# Altium schematic sheet CPCISerial_connector.SchDoc: CPCIS connector
size 420 x 297 mm; CheckedBy: A.Paixao; CompanyName: CERN; DrawnBy: G. Daniluk; Engineer: G. Daniluk; Organization: CERN; Address1: European Organization for Nuclear Research; Address2: CH-1211 Genève 23 - Switzerland; DocumentNumber: 10; SheetNumber: 10; SheetTotal: 10; Title2: P1; DivGrp: BE/CO; Designer: G. Daniluk; Projet: Banker; ModifiedBy: G.Kasprowicz; CheckedDate: 18/06/2018; ProjectName: Distributed I/O Tier
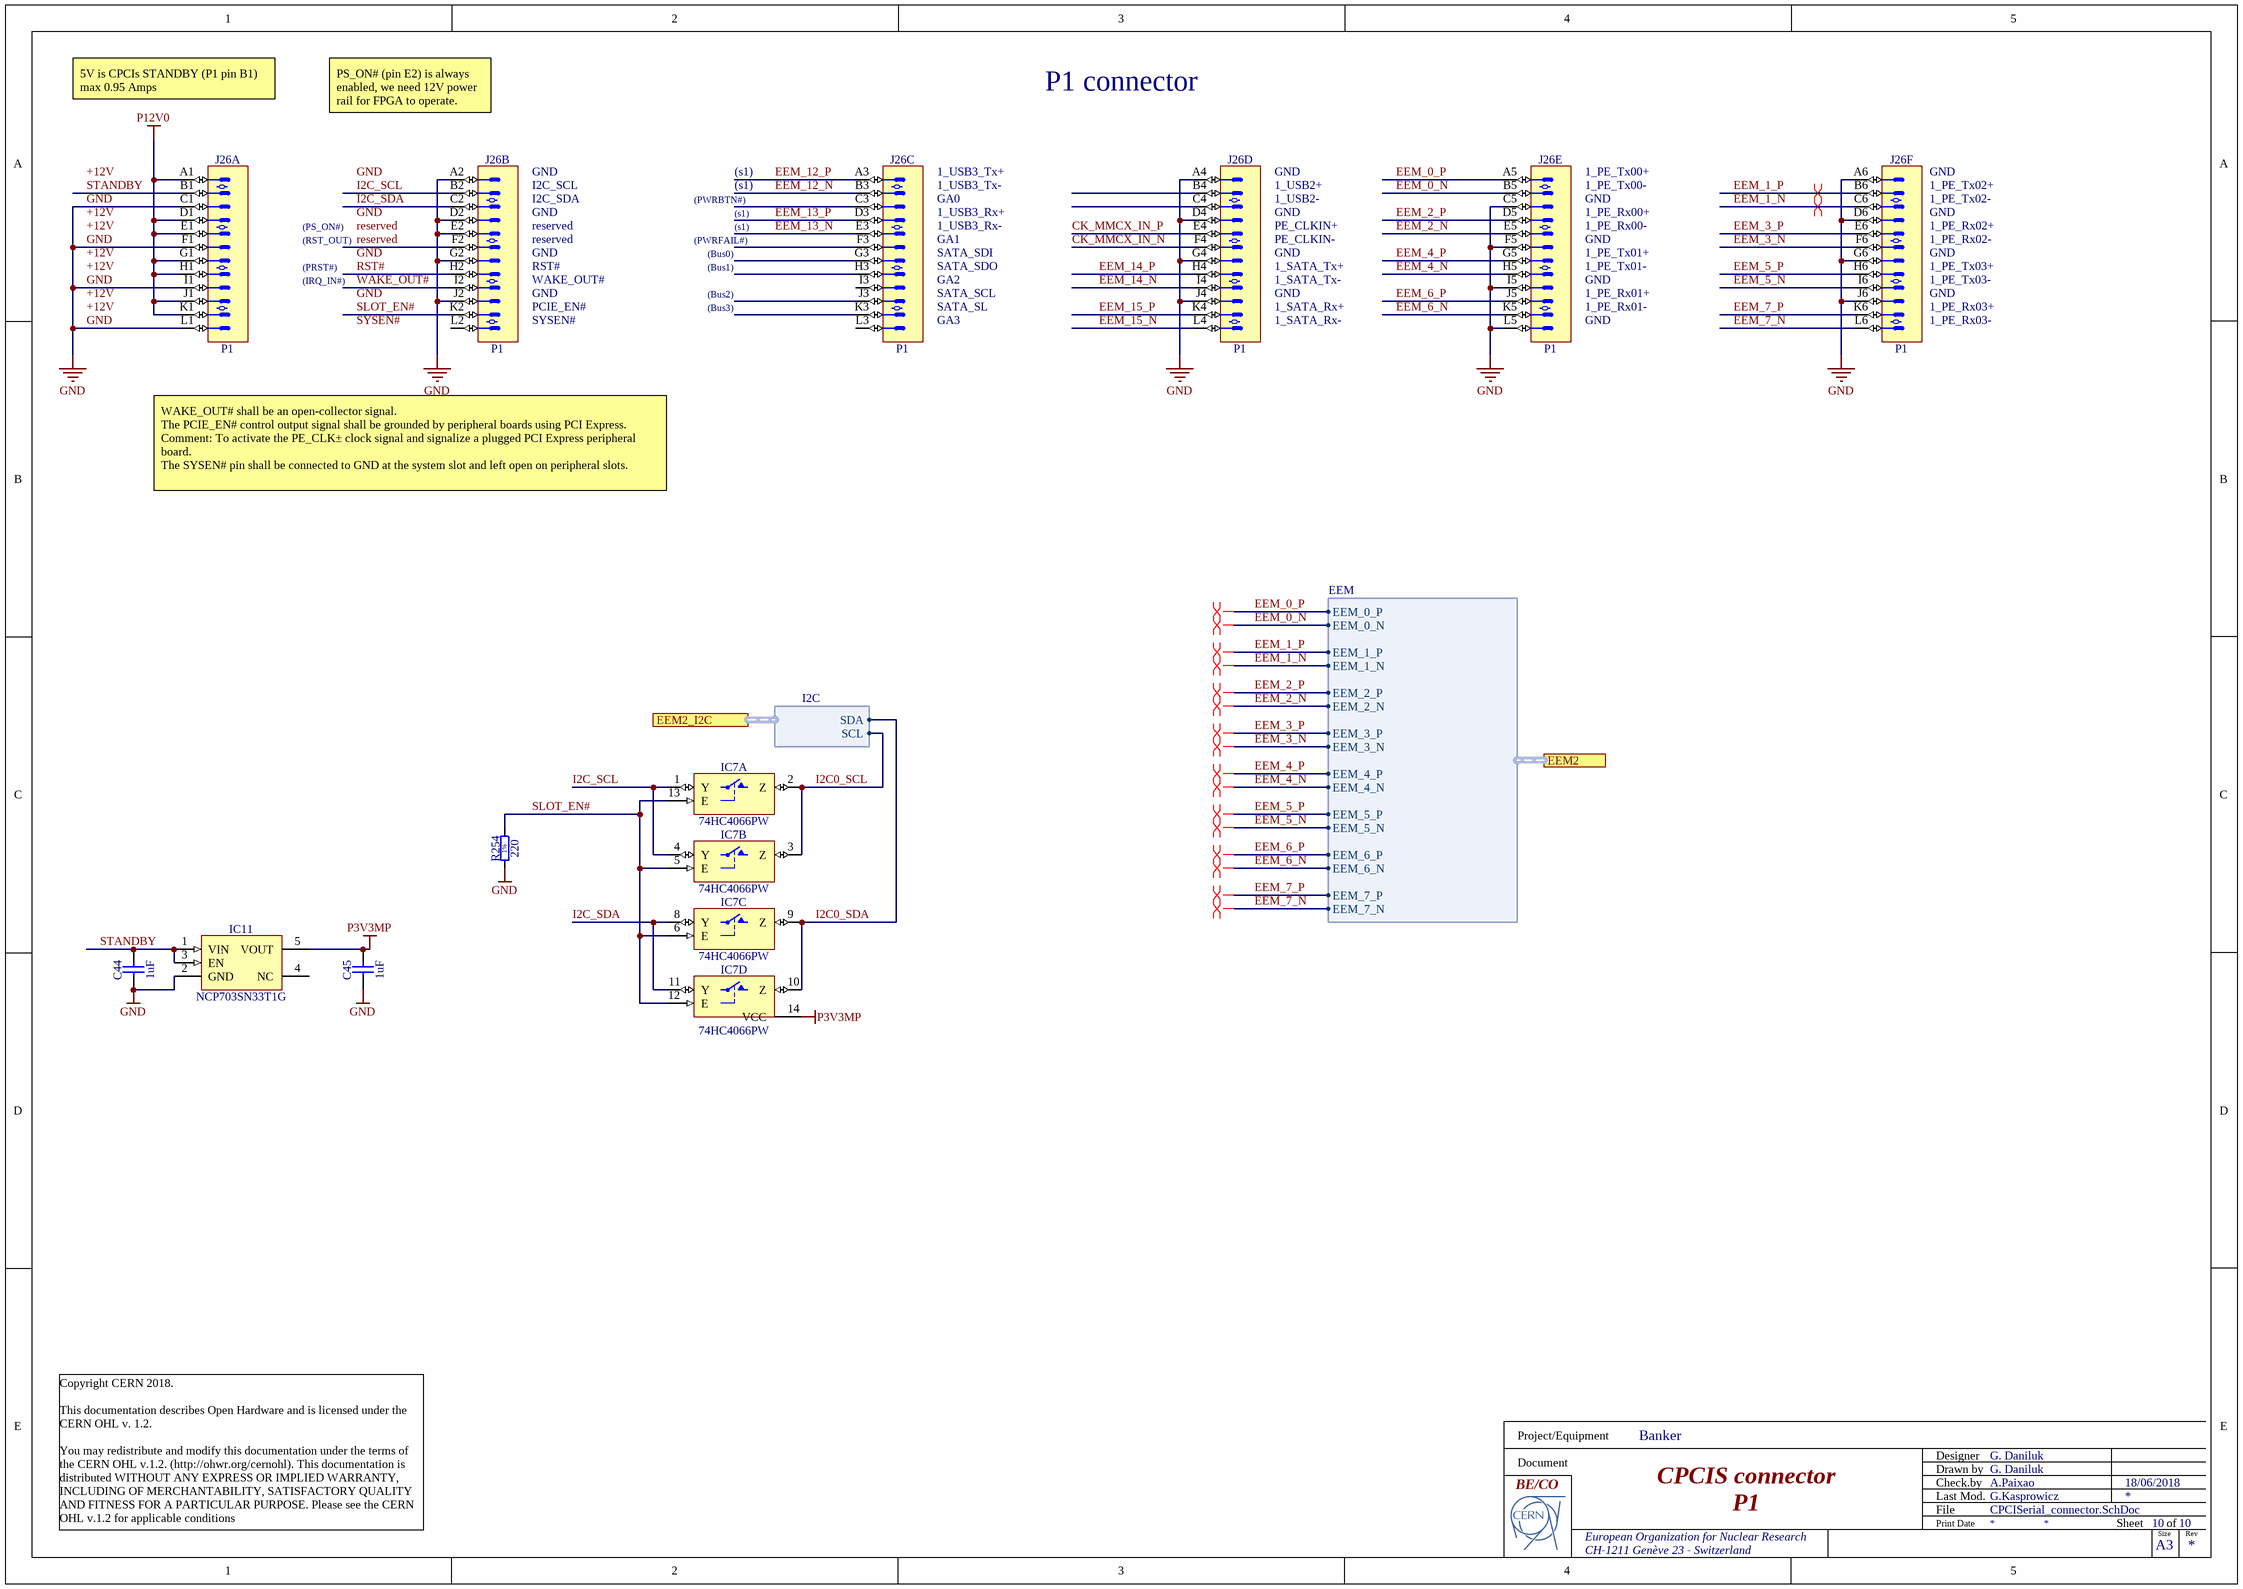
[diagram p0: CPCISerial_connector.SchDoc]

## Parts
C44  1uF  [CAPC2012X140N]
C45  1uF  [CAPC2012X140N]
IC7  74HC4066PW  [SOP65P640X110-14N]  (parts A,B,C,D of 4)
IC11  NCP703SN33T1G  [SOT95P275X110-5N]
J26  P1  [AMPHENOL_10052825-101LF]  (parts A,B,C,D,E,F of 6)
R254  220  [RESC1608X55N]

## Ports
EEM2 (harness EEM), EEM2_I2C (harness I2C)

## Harnesses
EEM: EEM_0_P, EEM_0_N, EEM_1_P, EEM_1_N, EEM_2_P, EEM_2_N, EEM_3_P, EEM_3_N, EEM_4_P, EEM_4_N, EEM_5_P, EEM_5_N, EEM_6_P, EEM_6_N, EEM_7_P, EEM_7_N
I2C: SDA, SCL

## Nets
GND: C44.1 C45.1 IC7.7(GND) IC11.2(GND) J26.A2 J26.A4 J26.A6 J26.C1 J26.C5 J26.D2 J26.D4 J26.D6 J26.E2 J26.F1 J26.F5 J26.G2 J26.G4 J26.G6 J26.I1 J26.I5 J26.J2 J26.J4 J26.J6 J26.L1 J26.L5 R254.1
P3V3MP: C45.2 IC7.14(VCC) IC11.5(VOUT)
P12V0: J26.A1 J26.D1 J26.E1 J26.G1 J26.H1 J26.J1 J26.K1
VCC: IC7.14(VCC)
CK_MMCX_IN_N: J26.F4
CK_MMCX_IN_P: J26.E4
EEM_0_N: J26.B5 ; port EEM2.EEM_0_N
EEM_0_P: J26.A5 ; port EEM2.EEM_0_P
EEM_1_N: J26.C6 ; port EEM2.EEM_1_N
EEM_1_P: J26.B6 ; port EEM2.EEM_1_P
EEM_2_N: J26.E5 ; port EEM2.EEM_2_N
EEM_2_P: J26.D5 ; port EEM2.EEM_2_P
EEM_3_N: J26.F6 ; port EEM2.EEM_3_N
EEM_3_P: J26.E6 ; port EEM2.EEM_3_P
EEM_4_N: J26.H5 ; port EEM2.EEM_4_N
EEM_4_P: J26.G5 ; port EEM2.EEM_4_P
EEM_5_N: J26.I6 ; port EEM2.EEM_5_N
EEM_5_P: J26.H6 ; port EEM2.EEM_5_P
EEM_6_N: J26.K5 ; port EEM2.EEM_6_N
EEM_6_P: J26.J5 ; port EEM2.EEM_6_P
EEM_7_N: J26.L6 ; port EEM2.EEM_7_N
EEM_7_P: J26.K6 ; port EEM2.EEM_7_P
EEM_12_N: J26.B3
EEM_12_P: J26.A3
EEM_13_N: J26.E3
EEM_13_P: J26.D3
EEM_14_N: J26.I4
EEM_14_P: J26.H4
EEM_15_N: J26.L4
EEM_15_P: J26.K4
I2C0_SCL: IC7.2(Z) IC7.3(Z) ; port EEM2_I2C.SCL
I2C0_SDA: IC7.9(Z) IC7.10(Z) ; port EEM2_I2C.SDA
I2C_SCL: IC7.1(Y) IC7.4(Y) J26.B2
I2C_SDA: IC7.8(Y) IC7.11(Y) J26.C2
reserved: J26.F2
RST#: J26.H2
SLOT_EN#: IC7.5(E) IC7.6(E) IC7.12(E) IC7.13(E) J26.K2 R254.2
STANDBY: C44.2 IC11.1(VIN) IC11.3(EN) J26.B1
WAKE_OUT#: J26.I2

Not connected (* = marked no-connect by the designer): IC11 4(NC); J26 B4 C3 C4 F3 G3 H3 I3 J3 K3 L2 L3

## Layout directives
differential pair: EEM_0_N, EEM_0_P, EEM_1_N, EEM_1_P, EEM_2_N, EEM_2_P, EEM_3_N, EEM_3_P, EEM_4_N, EEM_4_P, EEM_5_N, EEM_5_P, EEM_6_N, EEM_6_P, EEM_7_N, EEM_7_P

## Notes on the sheet
- 5V is CPCIs STANDBY (P1 pin B1)
  max 0.95 Amps
- PS_ON# (pin E2) is always enabled, we need 12V power rail for FPGA to operate.
- P1 connector
- GND
- I2C_SCL
- (s1)
- 1_USB3_Tx+
- 1_USB3_Tx-
- 1_USB2+
- 1_PE_Tx00+
- 1_PE_Tx00-
- (near J26) GND
- (near J26) 1_PE_Tx02+
- (RST_OUT)
- (PS_ON#)
- I2C_SDA
- reserved
- (PWRBTN#)
- (PWRFAIL#)
- (Bus0)
- GA0
- 1_USB3_Rx+
- 1_USB3_Rx-
- GA1
- SATA_SDI
- 1_USB2-
- PE_CLKIN+
- PE_CLKIN-
- 1_PE_Rx00+
- 1_PE_Rx00-
- 1_PE_Tx01+
- (near J26) 1_PE_Tx02-
- (near J26) 1_PE_Rx02+
- (near J26) 1_PE_Rx02-
- (PRST#)
- (IRQ_IN#)
- RST#
- WAKE_OUT#
- PCIE_EN#
- SYSEN#
- (Bus1)
- (Bus2)
- (Bus3)
- SATA_SDO
- GA2
- SATA_SCL
- SATA_SL
- GA3
- 1_SATA_Tx+
- 1_SATA_Tx-
- 1_SATA_Rx+
- 1_SATA_Rx-
- 1_PE_Tx01-
- 1_PE_Rx01+
- 1_PE_Rx01-
- (near J26) 1_PE_Tx03+
- (near J26) 1_PE_Tx03-
- (near J26) 1_PE_Rx03+
- (near J26) 1_PE_Rx03-
- WAKE_OUT# shall be an open-collector signal.
  The PCIE_EN# control output signal shall be grounded by peripheral boards using PCI Express.
  Comment: To activate the PE_CLK± clock signal and signalize a plugged PCI Express peripheral board.
  The SYSEN# pin shall be connected to GND at the system slot and left open on peripheral slots.
- Copyright CERN 2018.
  This documentation describes Open Hardware and is licensed under the CERN OHL v. 1.2.
  You may redistribute and modify this documentation under the terms of the CERN OHL v.1.2. (http://ohwr.org/cernohl). This documentation is distributed WITHOUT ANY EXPRESS OR IMPLIED WARRANTY, INCLUDING OF MERCHANTABILITY, SATISFACTORY QUALITY AND FITNESS FOR A PARTICULAR PURPOSE. Please see the CERN OHL v.1.2 for applicable conditions
- Labels drawn without touching a wire or pin: +12V, GND, reserved, SYSEN#
- Project/Equipment
- Document
- Designer
- Drawn by
- Check.by
- File
- Last Mod.
- Print Date
- Sheet
- Size
- A3
- of
- Rev
- (in symbol R0603_220R_1%_0.1W_100PPM) 1%

## Library data of the parts
C44 C45 = CC0805_1UF_35V_20%_X7R: Non-polarised capacitor; Part Description: SMD Multilayer Chip Ceramic Capacitor; Manufacturer: GENERIC; Manufacturer1 Part Number: GMK212B7105MG-T; Voltage: 35V; TC: X7R; Tolerance: ±20%; Part Number: CC0805_1UF_35V_20%_X7R; Component Kind: Standard; Component Type: Standard; Pin Count: 2; Value: 1uF; Status: Not Recommended; Manufacturer Part Number: CC0805_1UF_35V_20%_X7R; Case: 0805; Mounted: Yes; Socket: No; SMD: Yes; Sense: No; Manufacturer1 Example: TAIYO YUDEN; Manufacturer1 ComponentHeight: 1.35mm; HelpURL: \\cern.ch\dfs\Applications\Altium\Datasheets\CC0805_X7R_TAIYO-YUDEN_HIGH-VALUE.pdf; Author: CERN DEM JLC; CreateDate: 22.06.2011; LatestRevisionDate: 22.06.2011
IC7 = 74HC4066PW: Part Description: Quad Single-Pole Single-Throw Analog Switch; Manufacturer: NXP SEMICONDUCTORS; PressFit: No; Bonding: No; Part Number: 74HC4066PW; Component Kind: Standard; Component Type: Standard; Device: 74HC4066PW; PackageDescription: SOP, 14-Leads, Body 4.4x5mm (max), Pitch 0.65mm, IPC Medium Density; Manufacturer Part Number: 74HC4066PW; Pin Count: 14; Case: TSSOP14; Mounted: Yes; Socket: No; SMD: Yes; Sense: No; ComponentHeight: 1.1mm; Author: CERN DEM JLC; HelpURL: \\cern.ch\dfs\Applications\Altium\Datasheets\74HC4066PW.pdf; CreateDate: 19.11.2014; LatestRevisionDate: 19.11.2014
IC11 = NCP703SN33T1G: 3.3V 300mA, Ultra-Low Quiescent Current, IQ 12uA, Ultra-Low Noise, LDO Voltage Regulator; Manufacturer: ON SEMICONDUCTOR; PressFit: No; Bonding: No; Part Number: NCP703SN33T1G; Component Kind: Standard; Component Type: Standard; Device: NCP703SN33T1G; PackageDescription: SOT, 0.95mm Pitch; 5 Pin, 1.50mm W X 3.00mm L X 1.10mm H Body, IPC Medium Density; Part Description: 3.3V 300mA, Ultra-Low Quiescent Current, IQ 12uA, Ultra-Low Noise, LDO Voltage Regulator; Manufacturer Part Number: NCP703SN33T1G; Pin Count: 5; Case: SOT23-5; Mounted: Yes; Socket: No; SMD: Yes; Sense: No; ComponentHeight: 1.1mm; HelpURL: \\cern.ch\dfs\Applications\Altium\Datasheets\NCP703SN33T1G.pdf; Author: CERN DEM JLC; CreateDate: 16.02.2017; LatestRevisionDate: 16.02.2017
J26 = AMPHENOL_10052825-101LF: 72 Contacts Header, 6 Columns, 4 Pairs per Column; Part Description: 72 Contacts, 2mm Pitch, 6 Columns, 4 Pairs per Column, 4 Walls, Right Angle Header; Part Number: AMPHENOL_10052825-101LF; Component Kind: Standard; Component Type: Standard; Pin Count: 72; Family: AirMax VS; Mounted: Yes; Socket: No; SMD: No; PressFit: Yes; Sense: No; Status: None; Manufacturer: AMPHENOL; Manufacturer Part Number: 10052825-101LF; ComponentHeight: 15.35mm; HelpURL: \\cern.ch\dfs\Applications\Altium\Datasheets\AMPHENOL_10052825-101LF.pdf; ComponentLink1URL: \\cern.ch\dfs\Applications\Altium\Datasheets\AMPHENOL_10052825-101LF_Application.pdf; ComponentLink1Description: Application; Author: CERN DEM MR; CreateDate: 19/02/2018; LatestRevisionDate: 19/02/2018; Classname: Overlapping
R254 = R0603_220R_1%_0.1W_100PPM: Resistor - 1%; Part Description: General Purpose Thick Film Chip Resistor; Manufacturer: GENERIC; Manufacturer1 Part Number: NRC06F2200TRF; Power: 0.1W; TC: ±100ppm/°C; PressFit: No; Part Number: R0603_220R_1%_0.1W_100PPM; Component Kind: Standard; Component Type: Standard; Pin Count: 2; Value: 220; Status: Preferred; Tolerance: ±1%; Manufacturer Part Number: R0603_220R_1%_0.1W_100PPM; Case: 0603; Mounted: Yes; Sense: No; Socket: No; SMD: Yes; Manufacturer1 Example: NIC COMPONENT; Manufacturer1 ComponentHeight: 0.55mm; HelpURL: \\cern.ch\dfs\Applications\Altium\Datasheets\R0603_NIC_NRC.pdf; Author: CERN DEM JLC; CreateDate: 03.12.2007; LatestRevisionDate: 13.03.2008